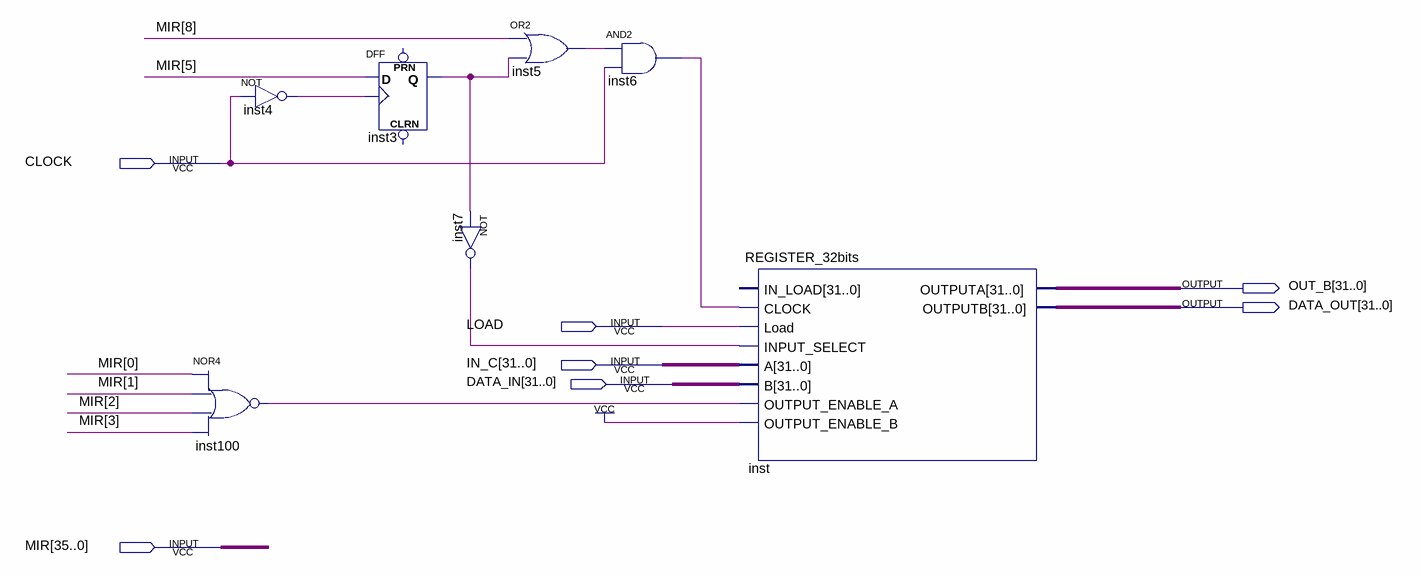
[diagram p0: schematic sheet]
// Quartus schematic MDR.bdf as structural Verilog: 7 symbols, 7 pins
module MDR (
  input  CLOCK,
  input  LOAD,
  input  [31:0] IN_C,
  input  [31:0] DATA_IN,
  input  [35:0] MIR,
  output [31:0] OUT_B,
  output [31:0] DATA_OUT
);

  wire inst3_q, inst4_out, inst5_out, inst6_out, inst7_out, inst100_out;

  nor inst100 (inst100_out, MIR[0], MIR[1], MIR[2], MIR[3]);
  not inst4 (inst4_out, CLOCK);
  DFF inst3 (.CLK(inst4_out), .D(MIR[5]), .Q(inst3_q));  // open: CLRN, PRN
  or inst5 (inst5_out, MIR[8], inst3_q);
  not inst7 (inst7_out, inst3_q);
  and inst6 (inst6_out, inst5_out, CLOCK);
  REGISTER_32bits inst (
    .CLOCK(inst6_out), .Load(LOAD), .INPUT_SELECT(inst7_out), .A(IN_C), .B(DATA_IN),
    .OUTPUT_ENABLE_A(inst100_out), .OUTPUT_ENABLE_B(1'b1), .OUTPUTA(OUT_B), .OUTPUTB(DATA_OUT));  // open: IN_LOAD
endmodule
